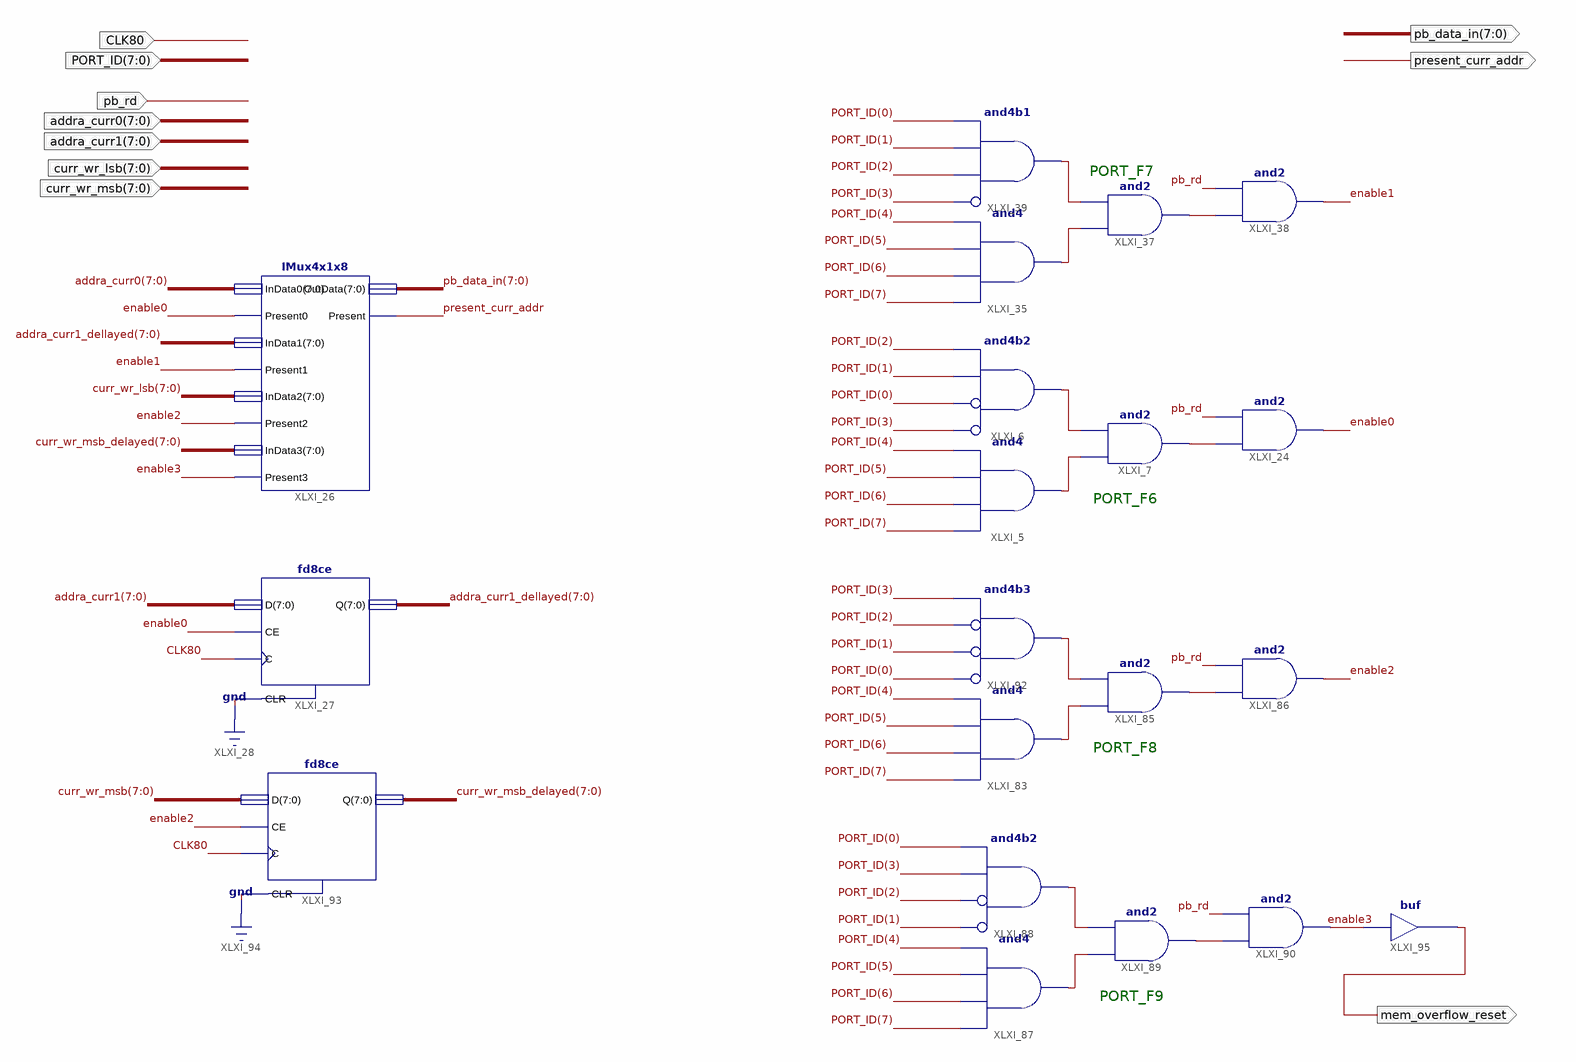
[diagram p0: schematic sheet 1]
// Xilinx ISE schematic curr_w_addr.sch (spartan6) as structural Verilog: 20 symbols, 10 ports
module curr_w_addr (
  input  CLK80,
  input  [7:0] addra_curr0,
  input  [7:0] addra_curr1,
  input  pb_rd,
  input  [7:0] PORT_ID,
  input  [7:0] curr_wr_lsb,
  input  [7:0] curr_wr_msb,
  output [7:0] pb_data_in,
  output present_curr_addr,
  output mem_overflow_reset
);

  wire enable0, enable1, enable2, enable3, XLXN_32, XLXN_33, XLXN_114, XLXN_139, XLXN_140, XLXN_149,
       XLXN_269, XLXN_270, XLXN_279, XLXN_282, XLXN_283, XLXN_292;
  wire [7:0] addra_curr1_dellayed, curr_wr_msb_delayed;

  and XLXI_35 (XLXN_140, PORT_ID[7], PORT_ID[6], PORT_ID[5], PORT_ID[4]);
  and XLXI_37 (XLXN_149, XLXN_140, XLXN_139);
  and XLXI_38 (enable1, XLXN_149, pb_rd);
  and XLXI_39 (XLXN_139, ~PORT_ID[3], PORT_ID[2], PORT_ID[1], PORT_ID[0]);  // and4b1
  and XLXI_5 (XLXN_33, PORT_ID[7], PORT_ID[6], PORT_ID[5], PORT_ID[4]);
  and XLXI_6 (XLXN_32, ~PORT_ID[3], ~PORT_ID[0], PORT_ID[1], PORT_ID[2]);  // and4b2
  and XLXI_7 (XLXN_114, XLXN_33, XLXN_32);
  and XLXI_24 (enable0, XLXN_114, pb_rd);
  IMux4x1x8 XLXI_26 (
    .InData0(addra_curr0), .InData1(addra_curr1_dellayed), .InData2(curr_wr_lsb),
    .InData3(curr_wr_msb_delayed), .Present3(enable3), .Present2(enable2), .Present1(enable1),
    .Present0(enable0), .OutData(pb_data_in), .Present(present_curr_addr));
  fd8ce XLXI_27 (.C(CLK80), .CE(enable0), .CLR(1'b0), .D(addra_curr1), .Q(addra_curr1_dellayed));
  and XLXI_83 (XLXN_270, PORT_ID[7], PORT_ID[6], PORT_ID[5], PORT_ID[4]);
  and XLXI_85 (XLXN_279, XLXN_270, XLXN_269);
  and XLXI_86 (enable2, XLXN_279, pb_rd);
  and XLXI_87 (XLXN_283, PORT_ID[7], PORT_ID[6], PORT_ID[5], PORT_ID[4]);
  and XLXI_88 (XLXN_282, ~PORT_ID[1], ~PORT_ID[2], PORT_ID[3], PORT_ID[0]);  // and4b2
  and XLXI_89 (XLXN_292, XLXN_283, XLXN_282);
  and XLXI_90 (enable3, XLXN_292, pb_rd);
  and XLXI_92 (XLXN_269, ~PORT_ID[0], ~PORT_ID[1], ~PORT_ID[2], PORT_ID[3]);  // and4b3
  fd8ce XLXI_93 (.C(CLK80), .CE(enable2), .CLR(1'b0), .D(curr_wr_msb), .Q(curr_wr_msb_delayed));
  buf XLXI_95 (mem_overflow_reset, enable3);

  // Notes on the sheet:
  //   PORT_F7
  //   PORT_F6
  //   PORT_F8
  //   PORT_F9
endmodule
